# Altium schematic sheet RS485_Port.SchDoc
size A3; SheetNumber: 6; SheetTotal: 9
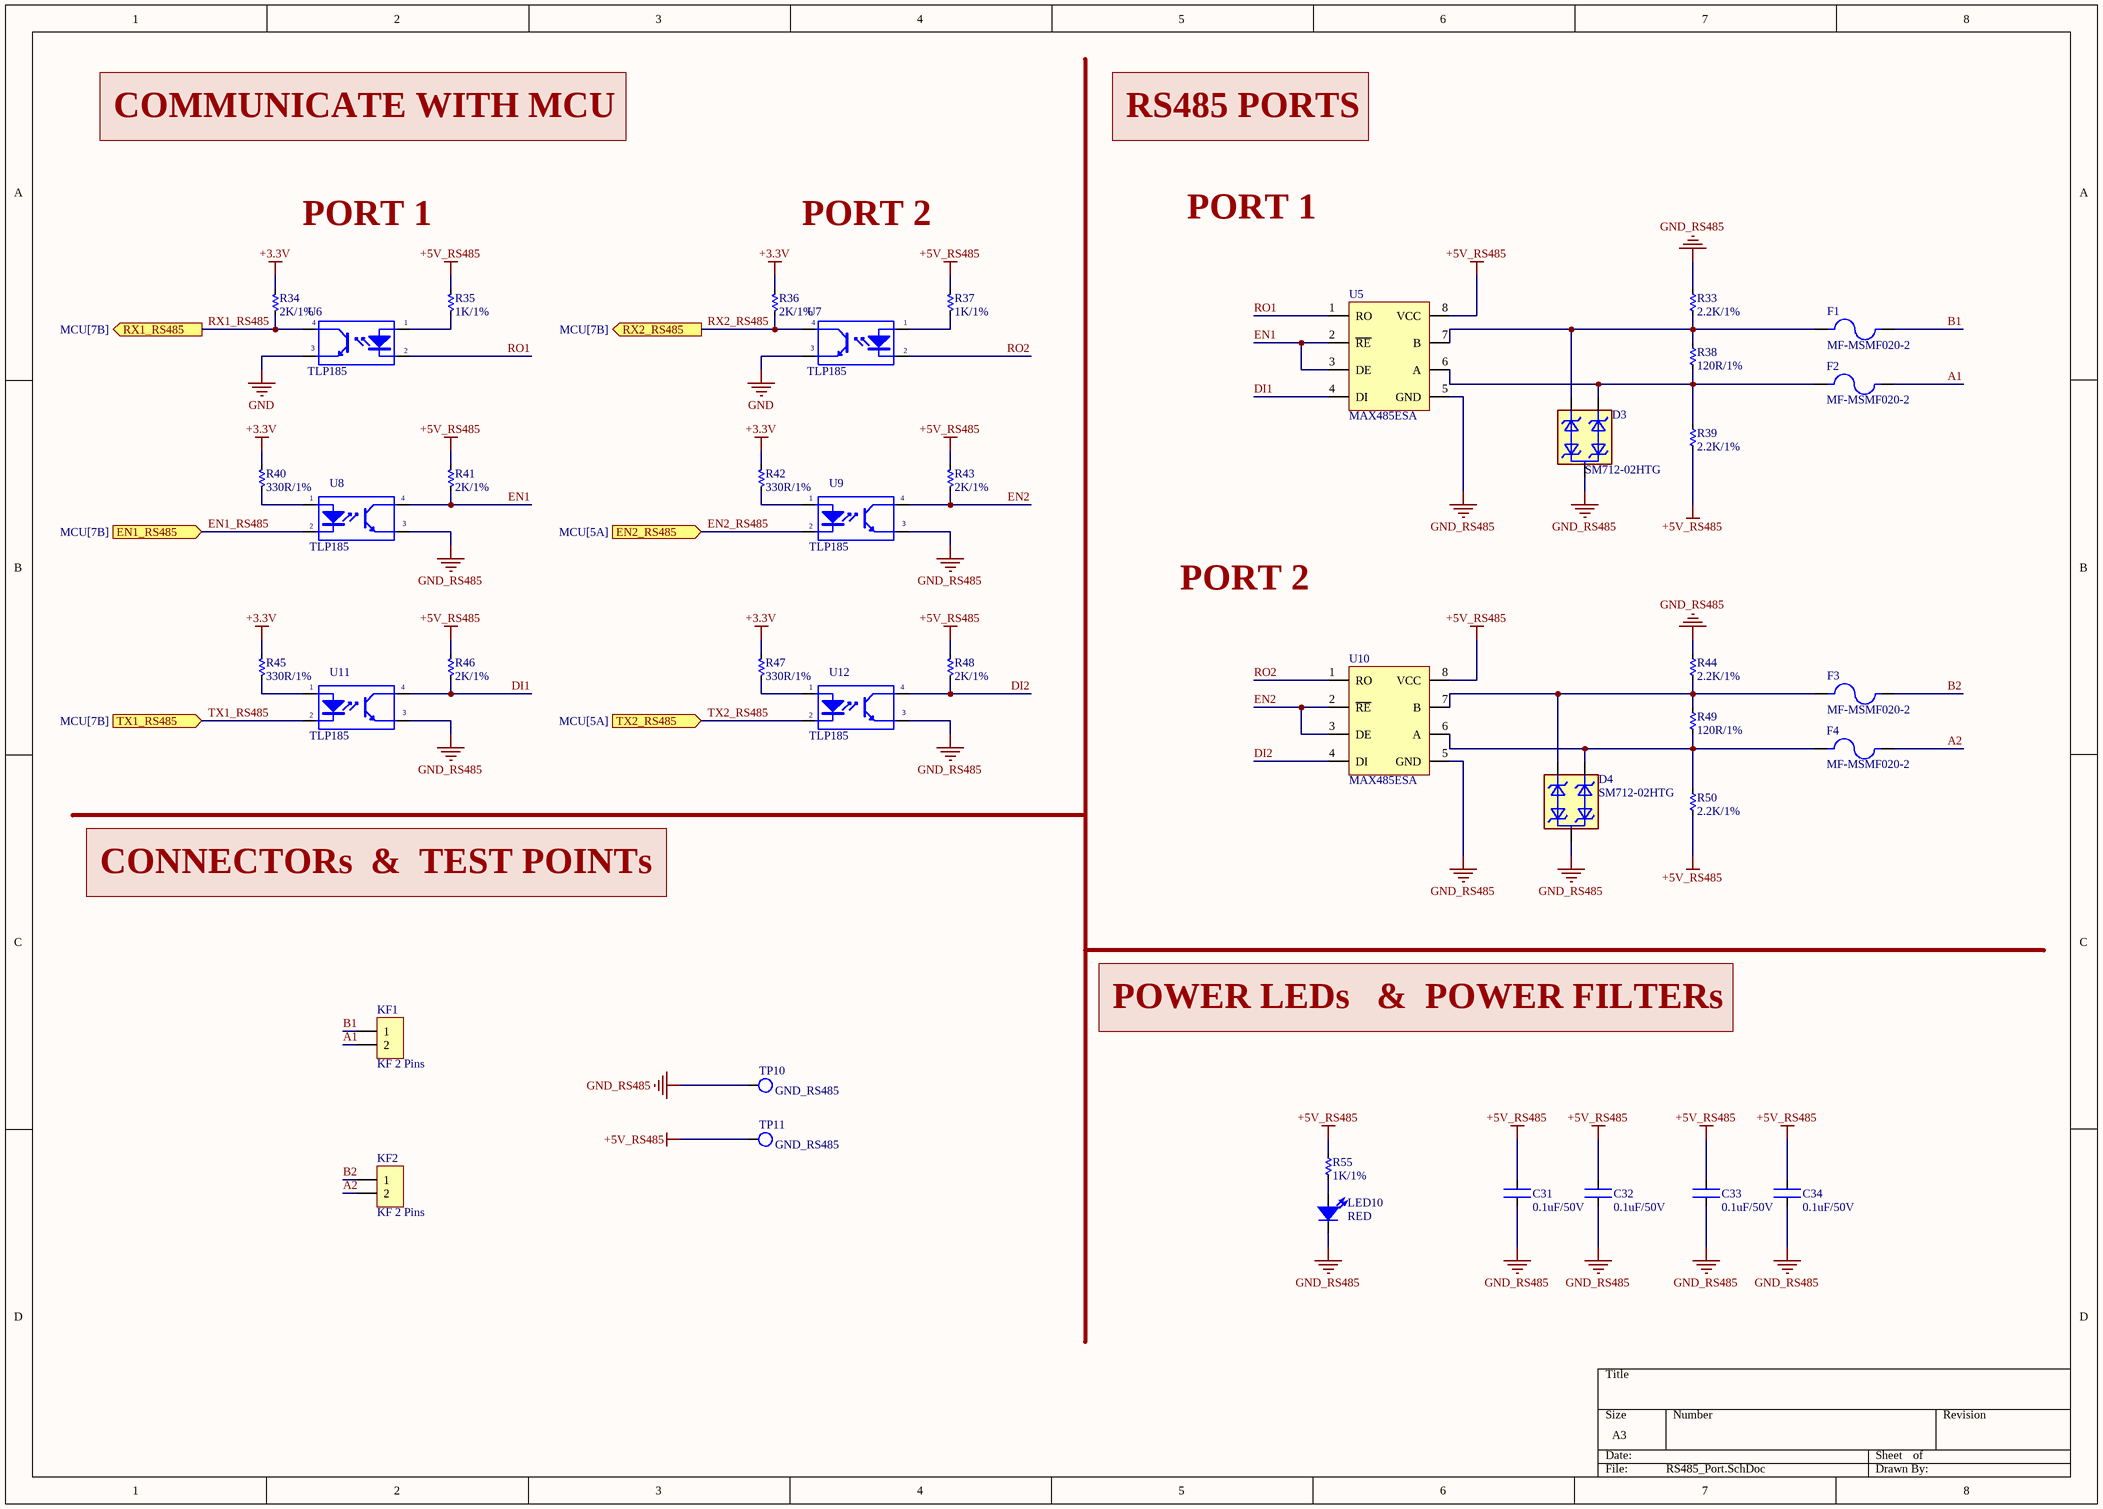
[diagram p0: RS485_Port.SchDoc]

## Parts
C31  0.1uF/50V  [CAP - 0603]
C32  0.1uF/50V  [CAP - 0603]
C33  0.1uF/50V  [CAP - 0603]
C34  0.1uF/50V  [CAP - 0603]
D3  SM712-02HTG  [SOT23-3]
D4  SM712-02HTG  [SOT23-3]
F1  MF-MSMF020-2  [Fuse 4.55x3.24 mm]
F2  MF-MSMF020-2  [Fuse 4.55x3.24 mm]
F3  MF-MSMF020-2  [Fuse 4.55x3.24 mm]
F4  MF-MSMF020-2  [Fuse 4.55x3.24 mm]
KF1  KF 2 Pins  [KF-5.08-2-R]
KF2  KF 2 Pins  [KF-5.08-2-R]
LED10  RED  [RED_LED_0603]
R33  2.2K/1%  [RES - 0603]
R34  2K/1%  [RES - 0603]
R35  1K/1%  [RES - 0603]
R36  2K/1%  [RES - 0603]
R37  1K/1%  [RES - 0603]
R38  120R/1%  [RES - 0603]
R39  2.2K/1%  [RES - 0603]
R40  330R/1%  [RES - 0603]
R41  2K/1%  [RES - 0603]
R42  330R/1%  [RES - 0603]
R43  2K/1%  [RES - 0603]
R44  2.2K/1%  [RES - 0603]
R45  330R/1%  [RES - 0603]
R46  2K/1%  [RES - 0603]
R47  330R/1%  [RES - 0603]
R48  2K/1%  [RES - 0603]
R49  120R/1%  [RES - 0603]
R50  2.2K/1%  [RES - 0603]
R55  1K/1%  [RES - 0603]
TP10  GND_RS485  [Test Point]
TP11  GND_RS485  [Test Point]
U5  MAX485ESA  [SOP_8]
U6  TLP185  [SOP-4]
U7  TLP185  [SOP-4]
U8  TLP185  [SOP-4]
U9  TLP185  [SOP-4]
U10  MAX485ESA  [SOP_8]
U11  TLP185  [SOP-4]
U12  TLP185  [SOP-4]

## Ports
EN1_RS485 (in, see MCU[7B]), EN2_RS485 (in, see MCU[5A]), RX1_RS485 (out, see MCU[7B]), RX2_RS485 (out, see MCU[7B]), TX1_RS485 (in, see MCU[7B]), TX2_RS485 (in, see MCU[5A])

## Nets
+3.3V: R34.2 R36.2 R40.2 R42.2 R45.2 R47.2
+5V_RS485: C31.1 C32.1 C33.1 C34.1 R35.2 R37.2 R39.1 R41.2 R43.2 R46.2 R48.2 R50.1 R55.1 TP11.1 U5.8(VCC) U10.8(VCC)
GND: U6.3(E) U7.3(E)
GND_RS485: C31.2 C32.2 C33.2 C34.2 D3.3 D4.3 LED10.2 R33.2 R44.2 TP10.1 U5.5(GND) U8.3(E) U9.3(E) U10.5(GND) U11.3(E) U12.3(E)
A1: F2.2 KF1.2
A2: F4.2 KF2.2
B1: F1.2 KF1.1
B2: F3.2 KF2.1
DI1: R46.1 U5.4(DI) U11.4(C)
DI2: R48.1 U10.4(DI) U12.4(C)
EN1: R41.1 U5.2(~{RE}) U5.3(DE) U8.4(C)
EN1_RS485: U8.2(K) ; port EN1_RS485
EN2: R43.1 U9.4(C) U10.2(~{RE}) U10.3(DE)
EN2_RS485: U9.2(K) ; port EN2_RS485
RO1: U5.1(RO) U6.2(K)
RO2: U7.2(K) U10.1(RO)
RX1_RS485: R34.1 U6.4(C) ; port RX1_RS485
RX2_RS485: R36.1 U7.4(C) ; port RX2_RS485
TX1_RS485: U11.2(K) ; port TX1_RS485
TX2_RS485: U12.2(K) ; port TX2_RS485
NetD3_1: D3.1 F2.1 R38.1 R39.2 U5.6(A)
NetD3_2: D3.2 F1.1 R33.1 R38.2 U5.7(B)
NetD4_1: D4.1 F4.1 R49.1 R50.2 U10.6(A)
NetD4_2: D4.2 F3.1 R44.1 R49.2 U10.7(B)
NetLED10_1: LED10.1 R55.2
NetR35_1: R35.1 U6.1(A)
NetR37_1: R37.1 U7.1(A)
NetR40_1: R40.1 U8.1(A)
NetR42_1: R42.1 U9.1(A)
NetR45_1: R45.1 U11.1(A)
NetR47_1: R47.1 U12.1(A)

## Notes on the sheet
- COMMUNICATE WITH MCU
- RS485 PORTS
- PORT 1
- PORT 2
- CONNECTORs  &  TEST POINTs
- POWER LEDs   &  POWER FILTERs

## Library data of the parts
C31-C34 = CAPACITOR: CAPACITOR SMD - KEMET
D3 D4 = SM712-02HTG: TVS Diode, SM712 Series, 31V Clamp, 600W Peak Pulse, Surface Mount, SOT23-3 | Littelfuse SM712-02HTG
F1-F4 = MF-MSMF020-2: Fuse Resettable 30V/0.2A; Size 4.55 x 3.24mm
KF1 KF2 = KF 2 Pins: KF Terminal Block Plug-in
LED10 = LED_SMD: LED SMD
R33-R50 R55 = RESISTOR: Resistor SMD - YAGEO
TP10 TP11 = TEST POINT: Supplier Part Number 1: 36-5014-ND; Supplier 1: Digikey
U5 U10 = MAX485ESA: 1/1 Transceiver Half RS422, RS485
U6-U9 U11 U12 = TLP185: TLP185 Optoisolator Transistor Output 3750Vrms 1 Channel 4-SOP